# Altium schematic sheet KeyMatrixRev2.SchDoc
size B
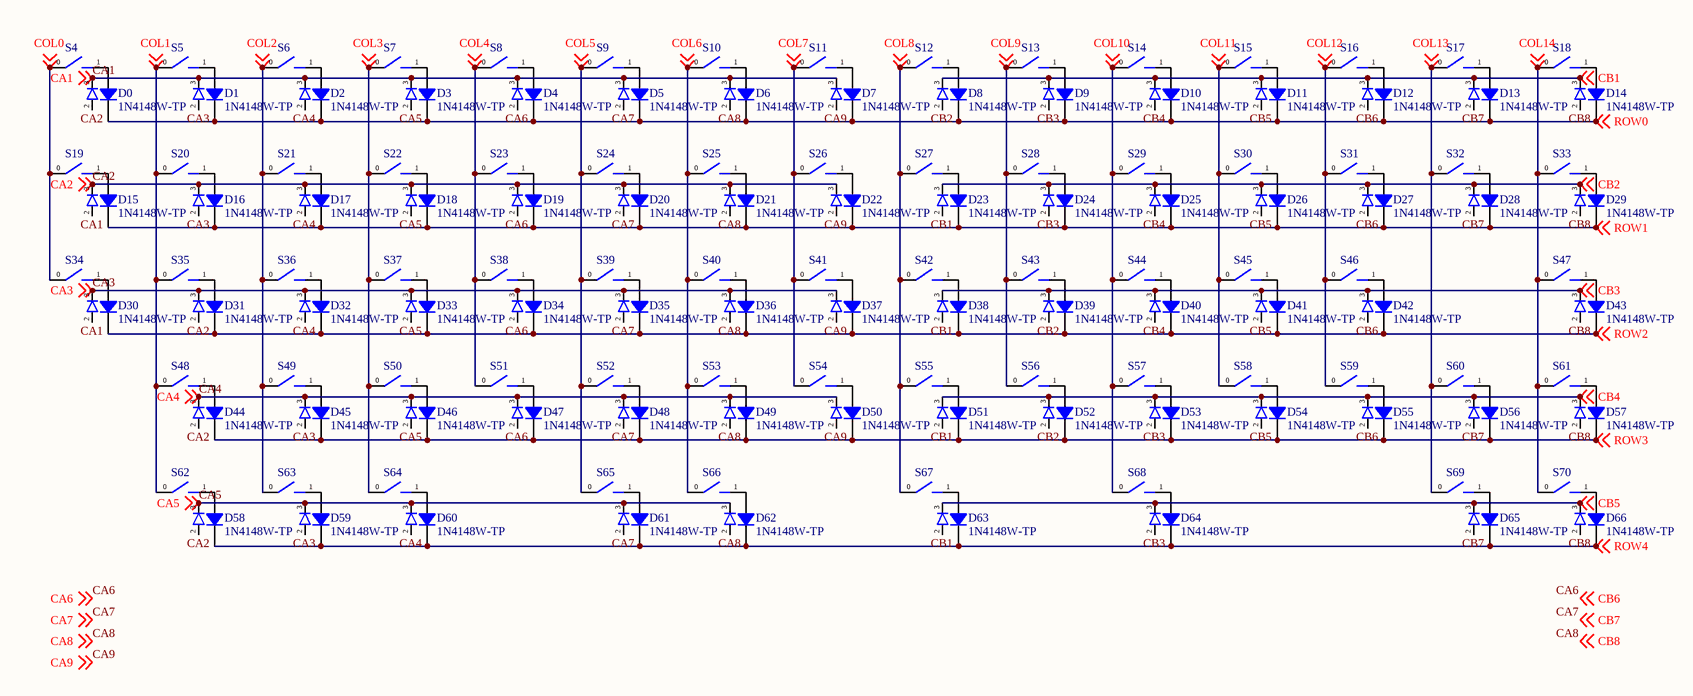
[diagram p0: KeyMatrixRev2.SchDoc]

## Parts
D0  1N4148W-TP  [SOD-123]
D1  1N4148W-TP  [SOD-123]
D2  1N4148W-TP  [SOD-123]
D3  1N4148W-TP  [SOD-123]
D4  1N4148W-TP  [SOD-123]
D5  1N4148W-TP  [SOD-123]
D6  1N4148W-TP  [SOD-123]
D7  1N4148W-TP  [SOD-123]
D8  1N4148W-TP  [SOD-123]
D9  1N4148W-TP  [SOD-123]
D10  1N4148W-TP  [SOD-123]
D11  1N4148W-TP  [SOD-123]
D12  1N4148W-TP  [SOD-123]
D13  1N4148W-TP  [SOD-123]
D14  1N4148W-TP  [SOD-123]
D15  1N4148W-TP  [SOD-123]
D16  1N4148W-TP  [SOD-123]
D17  1N4148W-TP  [SOD-123]
D18  1N4148W-TP  [SOD-123]
D19  1N4148W-TP  [SOD-123]
D20  1N4148W-TP  [SOD-123]
D21  1N4148W-TP  [SOD-123]
D22  1N4148W-TP  [SOD-123]
D23  1N4148W-TP  [SOD-123]
D24  1N4148W-TP  [SOD-123]
D25  1N4148W-TP  [SOD-123]
D26  1N4148W-TP  [SOD-123]
D27  1N4148W-TP  [SOD-123]
D28  1N4148W-TP  [SOD-123]
D29  1N4148W-TP  [SOD-123]
D30  1N4148W-TP  [SOD-123]
D31  1N4148W-TP  [SOD-123]
D32  1N4148W-TP  [SOD-123]
D33  1N4148W-TP  [SOD-123]
D34  1N4148W-TP  [SOD-123]
D35  1N4148W-TP  [SOD-123]
D36  1N4148W-TP  [SOD-123]
D37  1N4148W-TP  [SOD-123]
D38  1N4148W-TP  [SOD-123]
D39  1N4148W-TP  [SOD-123]
D40  1N4148W-TP  [SOD-123]
D41  1N4148W-TP  [SOD-123]
D42  1N4148W-TP  [SOD-123]
D43  1N4148W-TP  [SOD-123]
D44  1N4148W-TP  [SOD-123]
D45  1N4148W-TP  [SOD-123]
D46  1N4148W-TP  [SOD-123]
D47  1N4148W-TP  [SOD-123]
D48  1N4148W-TP  [SOD-123]
D49  1N4148W-TP  [SOD-123]
D50  1N4148W-TP  [SOD-123]
D51  1N4148W-TP  [SOD-123]
D52  1N4148W-TP  [SOD-123]
D53  1N4148W-TP  [SOD-123]
D54  1N4148W-TP  [SOD-123]
D55  1N4148W-TP  [SOD-123]
D56  1N4148W-TP  [SOD-123]
D57  1N4148W-TP  [SOD-123]
D58  1N4148W-TP  [SOD-123]
D59  1N4148W-TP  [SOD-123]
D60  1N4148W-TP  [SOD-123]
D61  1N4148W-TP  [SOD-123]
D62  1N4148W-TP  [SOD-123]
D63  1N4148W-TP  [SOD-123]
D64  1N4148W-TP  [SOD-123]
D65  1N4148W-TP  [SOD-123]
D66  1N4148W-TP  [SOD-123]
S4  Cherry  [CHERRY-MX-LED-1U]  (value not drawn)
S5  Cherry  [CHERRY-MX-LED-1U]  (value not drawn)
S6  Cherry  [CHERRY-MX-LED-1U]  (value not drawn)
S7  Cherry  [CHERRY-MX-LED-1U]  (value not drawn)
S8  Cherry  [CHERRY-MX-LED-1U]  (value not drawn)
S9  Cherry  [CHERRY-MX-LED-1U]  (value not drawn)
S10  Cherry  [CHERRY-MX-LED-1U]  (value not drawn)
S11  Cherry  [CHERRY-MX-LED-1U]  (value not drawn)
S12  Cherry  [CHERRY-MX-LED-1U]  (value not drawn)
S13  Cherry  [CHERRY-MX-LED-1U]  (value not drawn)
S14  Cherry  [CHERRY-MX-LED-1U]  (value not drawn)
S15  Cherry  [CHERRY-MX-LED-1U]  (value not drawn)
S16  Cherry  [CHERRY-MX-LED-1U]  (value not drawn)
S17  Cherry  [CHERRY-MX-LED-1U]  (value not drawn)
S18  Cherry  [CHERRY-MX-LED-2U]  (value not drawn)
S19  Cherry  [CHERRY-MX-LED-1U]  (value not drawn)
S20  Cherry  [CHERRY-MX-LED-1.5U]  (value not drawn)
S21  Cherry  [CHERRY-MX-LED-1U]  (value not drawn)
S22  Cherry  [CHERRY-MX-LED-1U]  (value not drawn)
S23  Cherry  [CHERRY-MX-LED-1U]  (value not drawn)
S24  Cherry  [CHERRY-MX-LED-1U]  (value not drawn)
S25  Cherry  [CHERRY-MX-LED-1U]  (value not drawn)
S26  Cherry  [CHERRY-MX-LED-1U]  (value not drawn)
S27  Cherry  [CHERRY-MX-LED-1U]  (value not drawn)
S28  Cherry  [CHERRY-MX-LED-1U]  (value not drawn)
S29  Cherry  [CHERRY-MX-LED-1U]  (value not drawn)
S30  Cherry  [CHERRY-MX-LED-1U]  (value not drawn)
S31  Cherry  [CHERRY-MX-LED-1U]  (value not drawn)
S32  Cherry  [CHERRY-MX-LED-1U]  (value not drawn)
S33  Cherry  [CHERRY-MX-LED-1.5U]  (value not drawn)
S34  Cherry  [CHERRY-MX-LED-1U]  (value not drawn)
S35  Cherry  [CHERRY-MX-LED-1.75U]  (value not drawn)
S36  Cherry  [CHERRY-MX-LED-1U]  (value not drawn)
S37  Cherry  [CHERRY-MX-LED-1U]  (value not drawn)
S38  Cherry  [CHERRY-MX-LED-1U]  (value not drawn)
S39  Cherry  [CHERRY-MX-LED-1U]  (value not drawn)
S40  Cherry  [CHERRY-MX-LED-1U]  (value not drawn)
S41  Cherry  [CHERRY-MX-LED-1U]  (value not drawn)
S42  Cherry  [CHERRY-MX-LED-1U]  (value not drawn)
S43  Cherry  [CHERRY-MX-LED-1U]  (value not drawn)
S44  Cherry  [CHERRY-MX-LED-1U]  (value not drawn)
S45  Cherry  [CHERRY-MX-LED-1U]  (value not drawn)
S46  Cherry  [CHERRY-MX-LED-1U]  (value not drawn)
S47  Cherry  [CHERRY-MX-LED-2.25U]  (value not drawn)
S48  Cherry  [CHERRY-MX-LED-2.25U]  (value not drawn)
S49  Cherry  [CHERRY-MX-LED-1U]  (value not drawn)
S50  Cherry  [CHERRY-MX-LED-1U]  (value not drawn)
S51  Cherry  [CHERRY-MX-LED-1U]  (value not drawn)
S52  Cherry  [CHERRY-MX-LED-1U]  (value not drawn)
S53  Cherry  [CHERRY-MX-LED-1U]  (value not drawn)
S54  Cherry  [CHERRY-MX-LED-1U]  (value not drawn)
S55  Cherry  [CHERRY-MX-LED-1U]  (value not drawn)
S56  Cherry  [CHERRY-MX-LED-1U]  (value not drawn)
S57  Cherry  [CHERRY-MX-LED-1U]  (value not drawn)
S58  Cherry  [CHERRY-MX-LED-1U]  (value not drawn)
S59  Cherry  [CHERRY-MX-LED-1U]  (value not drawn)
S60  Cherry  [CHERRY-MX-LED-1U]  (value not drawn)
S61  Cherry  [CHERRY-MX-LED-1U]  (value not drawn)
S62  Cherry  [CHERRY-MX-LED-1.25U]  (value not drawn)
S63  Cherry  [CHERRY-MX-LED-1.25U]  (value not drawn)
S64  Cherry  [CHERRY-MX-LED-1.5U]  (value not drawn)
S65  Cherry  [CHERRY-MX-LED-2U]  (value not drawn)
S66  Cherry  [CHERRY-MX-LED-1.25U]  (value not drawn)
S67  Cherry  [CHERRY-MX-LED-2.75U]  (value not drawn)
S68  Cherry  [CHERRY-MX-LED-1.5U]  (value not drawn)
S69  Cherry  [CHERRY-MX-LED-1.5U]  (value not drawn)
S70  Cherry  [CHERRY-MX-LED-1.5U]  (value not drawn)

## Nets
CA1: S4.3 S5.3 S6.3 S7.3 S8.3 S9.3 S10.3 S11.3 S19.2 S34.2 ; off-sheet CA1
CA2: S4.2 S19.3 S20.3 S21.3 S22.3 S23.3 S24.3 S25.3 S26.3 S35.2 S48.2 S62.2 ; off-sheet CA2
CA3: S5.2 S20.2 S34.3 S35.3 S36.3 S37.3 S38.3 S39.3 S40.3 S41.3 S49.2 S63.2 ; off-sheet CA3
CA4: S6.2 S21.2 S36.2 S48.3 S49.3 S50.3 S51.3 S52.3 S53.3 S54.3 S64.2 ; off-sheet CA4
CA5: S7.2 S22.2 S37.2 S50.2 S62.3 S63.3 S64.3 S65.3 S66.3 ; off-sheet CA5
CA6: S8.2 S16.2 S23.2 S31.2 S38.2 S46.2 S51.2 S59.2 ; off-sheet CA6, off-sheet CB6  [also labelled CB6]
CA7: S9.2 S17.2 S24.2 S32.2 S39.2 S52.2 S60.2 S65.2 S69.2 ; off-sheet CA7, off-sheet CB7  [also labelled CB7]
CA8: S10.2 S18.2 S25.2 S33.2 S40.2 S47.2 S53.2 S61.2 S66.2 S70.2 ; off-sheet CA8, off-sheet CB8  [also labelled CB8]
CA9: S11.2 S26.2 S41.2 S54.2 ; off-sheet CA9
CB1: S12.3 S13.3 S14.3 S15.3 S16.3 S17.3 S18.3 S27.2 S42.2 S55.2 S67.2 ; off-sheet CB1
CB2: S12.2 S27.3 S28.3 S29.3 S30.3 S31.3 S32.3 S33.3 S43.2 S56.2 ; off-sheet CB2
CB3: S13.2 S28.2 S42.3 S43.3 S44.3 S45.3 S46.3 S47.3 S57.2 S68.2 ; off-sheet CB3
CB4: S14.2 S29.2 S44.2 S55.3 S56.3 S57.3 S58.3 S59.3 S60.3 S61.3 ; off-sheet CB4
CB5: S15.2 S30.2 S45.2 S58.2 S67.3 S68.3 S69.3 S70.3 ; off-sheet CB5
COL0: S4.0 S19.0 S34.0 ; off-sheet COL0
COL1: S5.0 S20.0 S35.0 S48.0 S62.0 ; off-sheet COL1
COL2: S6.0 S21.0 S36.0 S49.0 S63.0 ; off-sheet COL2
COL3: S7.0 S22.0 S37.0 S50.0 S64.0 ; off-sheet COL3
COL4: S8.0 S23.0 S38.0 S51.0 ; off-sheet COL4
COL5: S9.0 S24.0 S39.0 S52.0 S65.0 ; off-sheet COL5
COL6: S10.0 S25.0 S40.0 S53.0 S66.0 ; off-sheet COL6
COL7: S11.0 S26.0 S41.0 S54.0 ; off-sheet COL7
COL8: S12.0 S27.0 S42.0 S55.0 S67.0 ; off-sheet COL8
COL9: S13.0 S28.0 S43.0 S56.0 ; off-sheet COL9
COL10: S14.0 S29.0 S44.0 S57.0 S68.0 ; off-sheet COL10
COL11: S15.0 S30.0 S45.0 S58.0 ; off-sheet COL11
COL12: S16.0 S31.0 S46.0 S59.0 ; off-sheet COL12
COL13: S17.0 S32.0 S60.0 S69.0 ; off-sheet COL13
COL14: S18.0 S33.0 S47.0 S61.0 S70.0 ; off-sheet COL14
ROW0: D0.2 D1.2 D2.2 D3.2 D4.2 D5.2 D6.2 D7.2 D8.2 D9.2 D10.2 D11.2 D12.2 D13.2 D14.2 ; off-sheet ROW0
ROW1: D15.2 D16.2 D17.2 D18.2 D19.2 D20.2 D21.2 D22.2 D23.2 D24.2 D25.2 D26.2 D27.2 D28.2 D29.2 ; off-sheet ROW1
ROW2: D30.2 D31.2 D32.2 D33.2 D34.2 D35.2 D36.2 D37.2 D38.2 D39.2 D40.2 D41.2 D42.2 D43.2 ; off-sheet ROW2
ROW3: D44.2 D45.2 D46.2 D47.2 D48.2 D49.2 D50.2 D51.2 D52.2 D53.2 D54.2 D55.2 D56.2 D57.2 ; off-sheet ROW3
ROW4: D58.2 D59.2 D60.2 D61.2 D62.2 D63.2 D64.2 D65.2 D66.2 ; off-sheet ROW4
NetD0_1: D0.1 S4.1
NetD1_1: D1.1 S5.1
NetD2_1: D2.1 S6.1
NetD3_1: D3.1 S7.1
NetD4_1: D4.1 S8.1
NetD5_1: D5.1 S9.1
NetD6_1: D6.1 S10.1
NetD7_1: D7.1 S11.1
NetD8_1: D8.1 S12.1
NetD9_1: D9.1 S13.1
NetD10_1: D10.1 S14.1
NetD11_1: D11.1 S15.1
NetD12_1: D12.1 S16.1
NetD13_1: D13.1 S17.1
NetD14_1: D14.1 S18.1
NetD15_1: D15.1 S19.1
NetD16_1: D16.1 S20.1
NetD17_1: D17.1 S21.1
NetD18_1: D18.1 S22.1
NetD19_1: D19.1 S23.1
NetD20_1: D20.1 S24.1
NetD21_1: D21.1 S25.1
NetD22_1: D22.1 S26.1
NetD23_1: D23.1 S27.1
NetD24_1: D24.1 S28.1
NetD25_1: D25.1 S29.1
NetD26_1: D26.1 S30.1
NetD27_1: D27.1 S31.1
NetD28_1: D28.1 S32.1
NetD29_1: D29.1 S33.1
NetD30_1: D30.1 S34.1
NetD31_1: D31.1 S35.1
NetD32_1: D32.1 S36.1
NetD33_1: D33.1 S37.1
NetD34_1: D34.1 S38.1
NetD35_1: D35.1 S39.1
NetD36_1: D36.1 S40.1
NetD37_1: D37.1 S41.1
NetD38_1: D38.1 S42.1
NetD39_1: D39.1 S43.1
NetD40_1: D40.1 S44.1
NetD41_1: D41.1 S45.1
NetD42_1: D42.1 S46.1
NetD43_1: D43.1 S47.1
NetD44_1: D44.1 S48.1
NetD45_1: D45.1 S49.1
NetD46_1: D46.1 S50.1
NetD47_1: D47.1 S51.1
NetD48_1: D48.1 S52.1
NetD49_1: D49.1 S53.1
NetD50_1: D50.1 S54.1
NetD51_1: D51.1 S55.1
NetD52_1: D52.1 S56.1
NetD53_1: D53.1 S57.1
NetD54_1: D54.1 S58.1
NetD55_1: D55.1 S59.1
NetD56_1: D56.1 S60.1
NetD57_1: D57.1 S61.1
NetD58_1: D58.1 S62.1
NetD59_1: D59.1 S63.1
NetD60_1: D60.1 S64.1
NetD61_1: D61.1 S65.1
NetD62_1: D62.1 S66.1
NetD63_1: D63.1 S67.1
NetD64_1: D64.1 S68.1
NetD65_1: D65.1 S69.1
NetD66_1: D66.1 S70.1

## Library data of the parts
D0-D66 = 1N4148W-TP: DIODE GEN PURP 100V 150MA SOD123; Manufacturer: Micro Commercial Co; Capacitance @ Vr, F: 2pF @ 0V, 1MHz; Current - Reverse Leakage @ Vr: 1µA @ 75V; Diode Type: Standard; Reverse Recovery Time (trr): 4ns; Speed: Small Signal =< 200mA (Io), Any Speed; Voltage - Forward (Vf) (Max) @ If: 1.25V @ 150mA; Part Number: 1N4148W-TP; ComponentLink1Description: Datasheet; ComponentLink1URL: https://www.mccsemi.com/pdf/Products/1N4148W(SOD123).pdf; ComponentLink2Description: DigiKey Link; ComponentLink2URL: http://digikey.com/product-detail/en/micro-commercial-co/1N4148W-TP/1N4148WTPMSCT-ND/717311; Current - Average Rectified (Io): 150mA; Device Package: SOD-123; LastUpdated: 1/21/2020 2:42:46 AM; Lifecycle Status: Active; Minimum Order: 1; Mounting Type: Surface Mount; Operating Temperature - Junction: -65°C ~ 150°C; Package / Case: SOD-123; Packaging: TapeAndReel; PartId: 999; Part Status: Active; Price: 0.02; Series: -; Supplier 1: DigiKey; Supplier Part Number 1: 1N4148WTPMSCT-ND; Supplier Device Package: SOD-123; Voltage - DC Reverse (Vr) (Max): 100V
S4-S70 = Cherry_Switch: Cherry SPST Keyswitch